# EAGLE design EggNunciator (EAGLE 4.13)
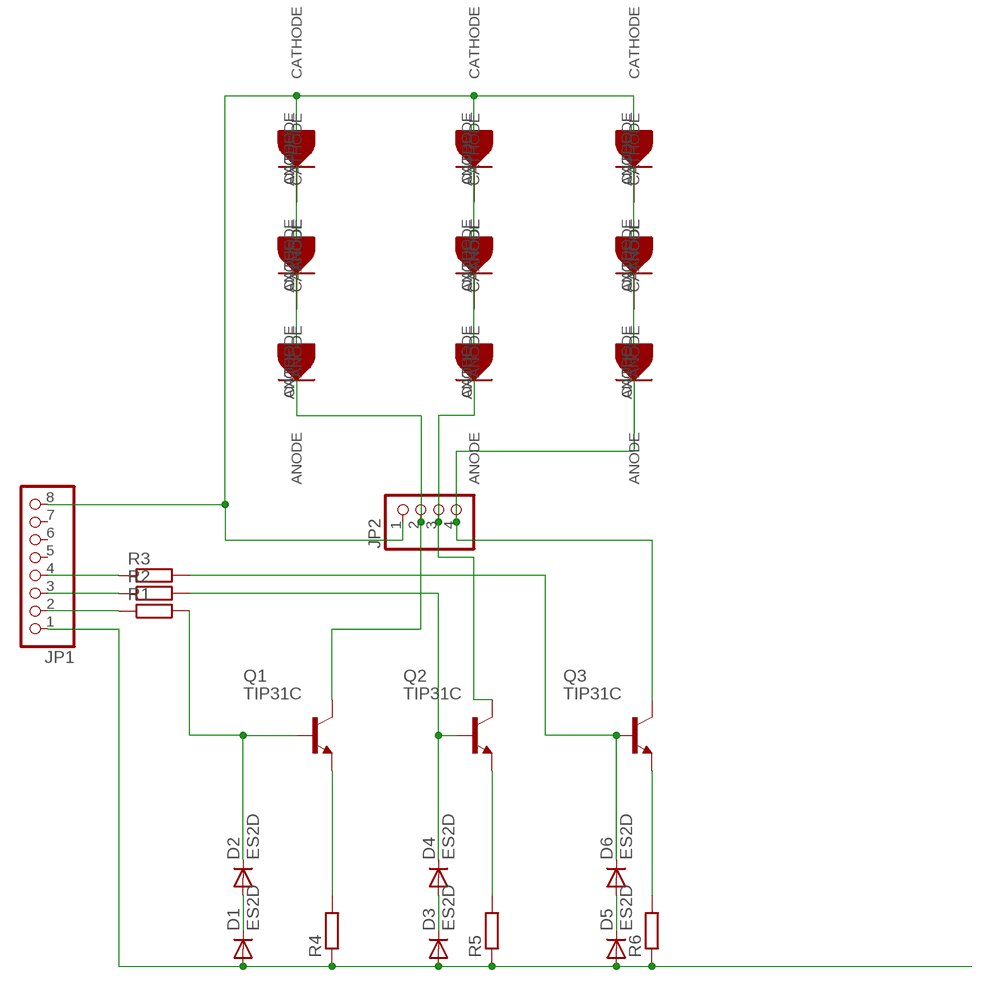
[diagram p0: schematic, sheet 1]

## Parts
D1  ES2D  [SMB]
D2  ES2D  [SMB]
D3  ES2D  [SMB]
D4  ES2D  [SMB]
D5  ES2D  [SMB]
D6  ES2D  [SMB]
JP1  PINHD-1X8  [1X08]
JP2  PINHD-1X4  [1X04]
Q1  TIP31C  [TO220]
Q2  TIP31C  [TO220]
Q3  TIP31C  [TO220]
R1  R-EU_M1206  [M1206]
R2  R-EU_M1206  [M1206]
R3  R-EU_M1206  [M1206]
R4  R-EU_0207/10  [0207/10]
R5  R-EU_0207/10  [0207/10]
R6  R-EU_0207/10  [0207/10]
RED  SUPERFLUXLED  [SUPERFLUXLED]
U$2  SUPERFLUXLED  [SUPERFLUXLED]
U$3  SUPERFLUXLED  [SUPERFLUXLED]
U$4  SUPERFLUXLED  [SUPERFLUXLED]
U$5  SUPERFLUXLED  [SUPERFLUXLED]
U$6  SUPERFLUXLED  [SUPERFLUXLED]
U$7  SUPERFLUXLED  [SUPERFLUXLED]
U$8  SUPERFLUXLED  [SUPERFLUXLED]
U$9  SUPERFLUXLED  [SUPERFLUXLED]

## Nets
GND: D1.A D3.A D5.A JP1.1 R4.1 R5.1 R6.1
N$2: JP1.2 R1.1
N$3: JP1.3 R2.1
N$4: JP1.4 R3.1
N$5: D1.C D2.A
N$6: D3.C D4.A
N$7: D5.C D6.A
N$8: D2.C Q1.1(B) R1.2
N$9: Q1.3(E) R4.2
N$10: D4.C Q2.1(B) R2.2
N$11: Q2.3(E) R5.2
N$12: Q3.3(E) R6.2
N$13: D6.C Q3.1(B) R3.2
N$14: JP1.8 JP2.1 U$3.CATHODE U$6.CATHODE U$9.CATHODE
N$15: JP2.2 Q1.2(C) RED.ANODE
N$16: JP2.3 Q2.2(C) U$4.ANODE
N$17: JP2.4 Q3.2(C) U$7.ANODE
N$18: U$7.CATHODE U$8.ANODE
N$19: U$4.CATHODE U$5.ANODE
N$20: RED.CATHODE U$2.ANODE
N$21: U$2.CATHODE U$3.ANODE
N$22: U$5.CATHODE U$6.ANODE
N$23: U$8.CATHODE U$9.ANODE
Unconnected: JP1.5 JP1.6 JP1.7

## Library data of the parts
D1-D6 = diode:ES2D: DIODE super fast rectifier, 2 A
JP1 = pinhead:PINHD-1X8: PIN HEADER
JP2 = pinhead:PINHD-1X4: PIN HEADER
Q1-Q3 = transistor-npn:TIP31C*: NPN Transistor
R1-R6 = rcl:R-EU_: RESISTOR, European symbol
RED U$2-U$9 = LumiLed:SUPERFLUXLED

## Board
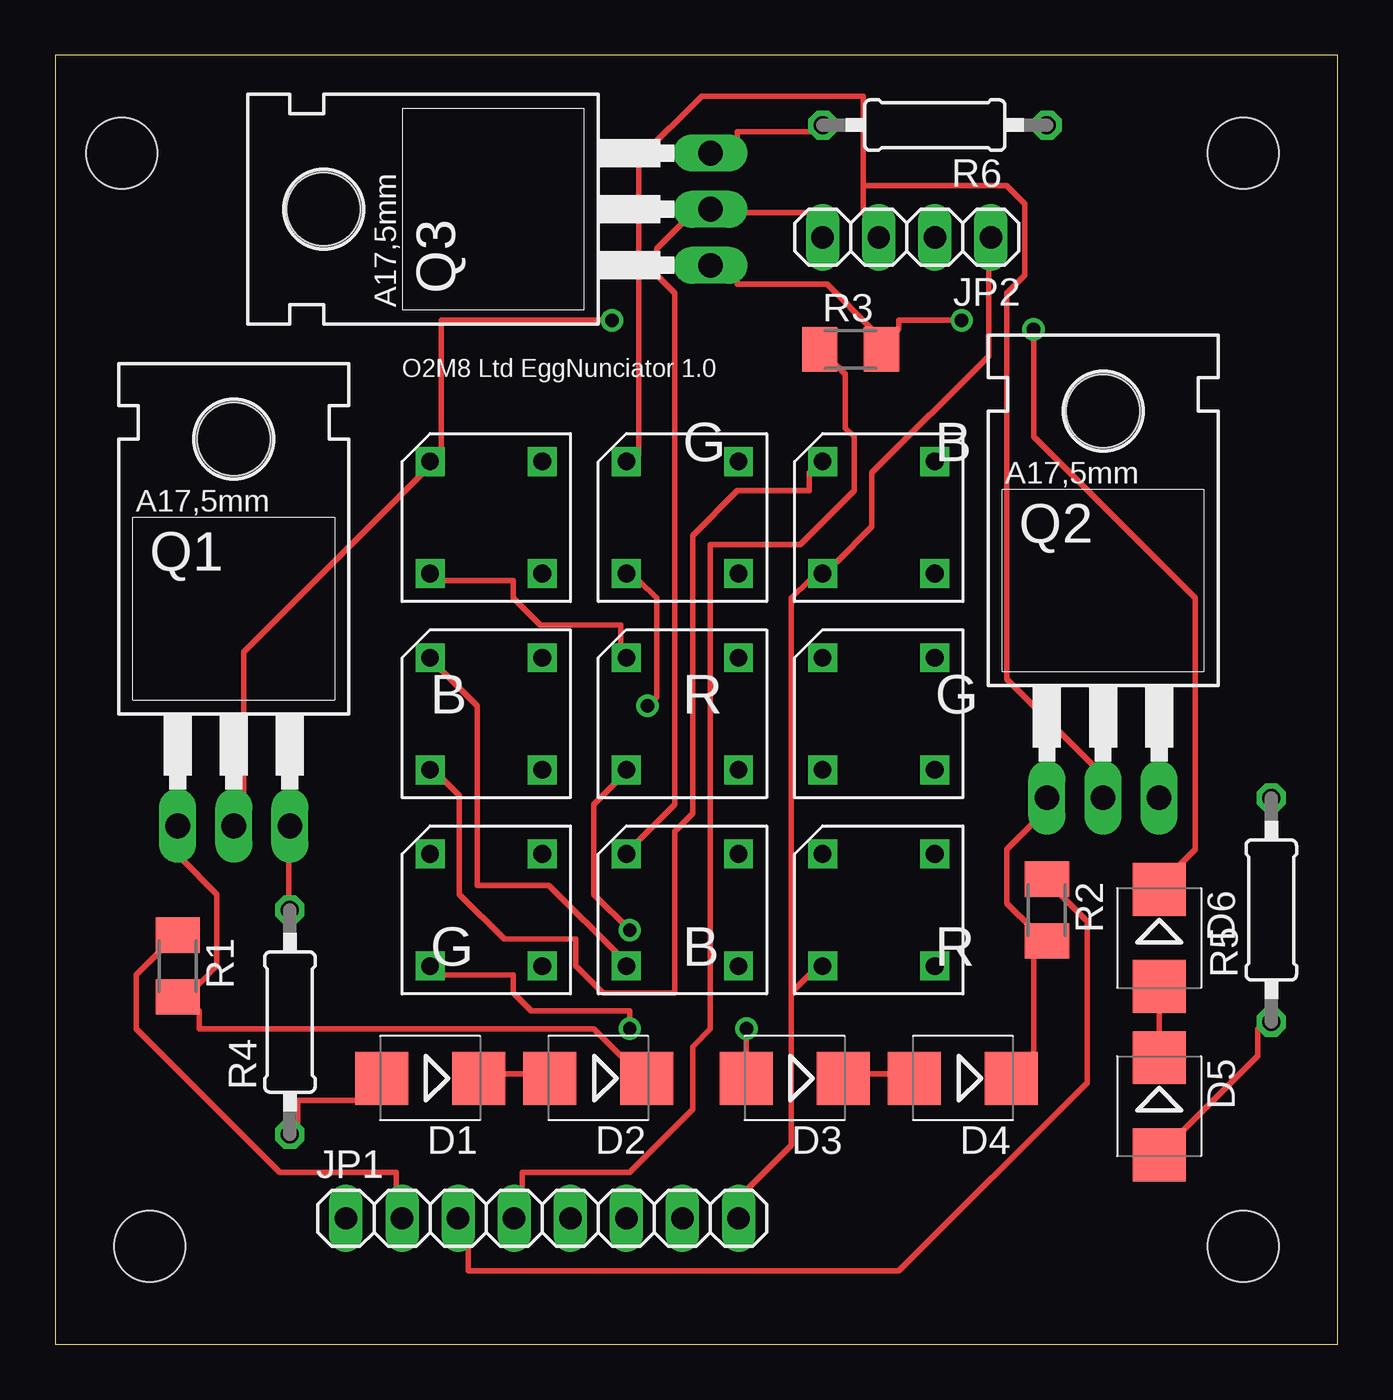
[diagram p1: board, top side]
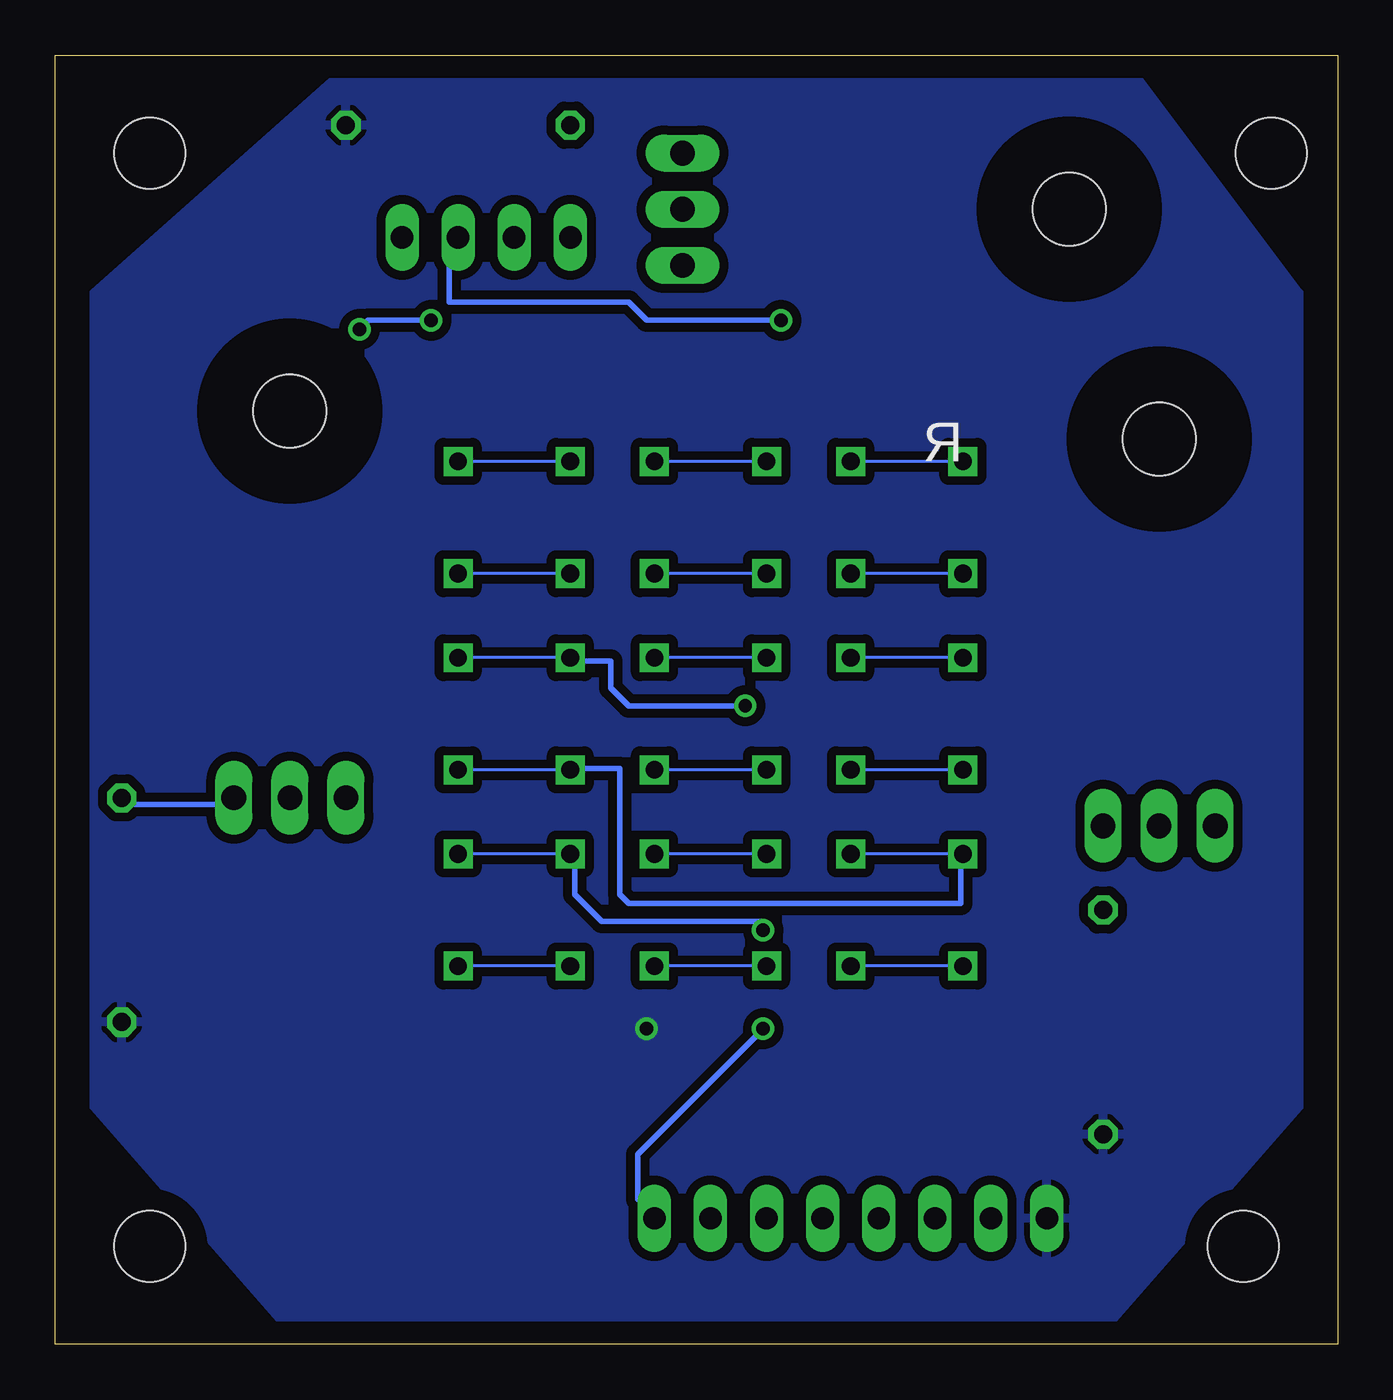
[diagram p2: board, bottom side, seen from below]

Size 58.09 x 58.41 mm. Coordinates in mm from the lower left corner, seen from the top.
Outline: 0,0 58.09,0 58.09,58.41 0,58.41 0,0
Copper layers (1*16): Top 0.035mm / dielectric 1.5mm / Bottom 0.035mm
Design rules "default": minimum track width 10mil, minimum drill 24mil, track to track 16mil, track to pad 16mil, pad to pad 12mil, via to via 12mil, smd to smd 12mil, copper to edge 40mil, drill to drill 8mil, minimum pad ring 10mil, minimum via ring 8mil, stop-mask expansion 4mil, vias tented up to drill 0mil, thermal gap 10mil
Holes 3.2 mm at 3.01,53.97 53.81,53.97 53.81,4.44 4.28,4.44

### Footprints (pad centres in the part's own frame; a part is rotated, then mirrored left to right if it is on the bottom)
SMB = smd 2.4 x 2.4: A 2.2,0; C -2.2,0
1X08 = drill 1.016 long: 1 -8.89,0; 2 -6.35,0; 3 -3.81,0; 4 -1.27,0; 5 1.27,0; 6 3.81,0; 7 6.35,0; 8 8.89,0
1X04 = drill 1.016 long: 1 -3.81,0; 2 -1.27,0; 3 1.27,0; 4 3.81,0
TO220 = drill 1.118 long: 1 -2.54,-6.35; 2 0,-6.35; 3 2.54,-6.35 | hole 3.302: 0,11.176
M1206 = smd 1.6 x 2: 1 -1.4,0; 2 1.4,0
0207/10 = drill 0.813 octagon: 1 -5.08,0; 2 5.08,0
SUPERFLUXLED = drill 0.8 square: ANODE -2.54,2.54; CATHODE -2.54,-2.54; P$2 2.54,2.54; P$4 2.54,-2.54

### Placement (x,y rotation side)
D1  16.98,12.06 180 top
D2  24.6,12.06 180 top
D3  33.49,12.06 180 top
D4  41.11,12.06 180 top
D5  50,10.79 270 top
D6  50,18.41 270 top
JP1  22.06,5.71 0 top
JP2  38.57,50.16 180 top
Q1  8.09,29.84 0 top
Q2  47.46,31.11 0 top
Q3  23.33,51.43 90 top
R1  5.55,17.14 270 top
R2  44.92,19.68 270 top
R3  36.03,45.08 0 top
R4  10.63,14.6 90 top
R5  55.08,19.68 90 top
R6  39.84,55.24 180 top
RED  19.52,37.46 0 top
U$2  28.41,28.57 0 top
U$3  37.3,19.68 0 top
U$4  28.41,37.46 0 top
U$5  37.3,28.57 0 top
U$6  19.52,19.68 0 top
U$7  28.41,19.68 0 top
U$8  19.52,28.57 0 top
U$9  37.3,37.46 0 top

### Tracks (layer width: path | path; a pad name or v marks a point on that pad's centre or on a via)
GND  (via drill 0.61)
  Top 0.254: D1.A 13.83,11.04 10.99,11.04 10.99,9.82 R4.1 | v31.31,14.3 31.31,13.08 D3.A | D5.A 50.81,9.42 54.47,13.08 54.47,14.3 R5.1
  pour Bottom: 1.74,47.62 9.36,57.78 44.92,57.78 56.35,47.62 56.35,10.79 47.46,0.63 10.63,0.63 1.74,10.79
N$2
  Top 0.254: R1.1 4.89,17.95 3.67,16.73 3.67,14.3 10.17,7.79 15.46,7.79 15.46,6.98 JP1.2
N$3
  Top 0.254: R2.1 45.53,20.39 46.75,19.17 46.75,11.86 38.21,3.32 18.71,3.32 18.71,4.54 JP1.3
N$4
  Top 0.254: R3.1 35.37,44.37 35.78,43.96 35.78,41.52 36.18,41.12 36.18,38.68 33.74,36.24 29.68,36.24 29.68,14.3 28.87,13.48 28.87,10.64 26.02,7.79 21.15,7.79 21.15,6.98 JP1.4
N$5
  Top 0.254: D1.C 20.33,12.26 21.55,12.26 D2.A
N$6
  Top 0.254: D3.C 36.59,12.26 37.81,12.26 D4.A
N$7
  Top 0.254: D5.C D6.A
N$8
  Top 0.254: Q1.1 5.7,22.02 7.33,20.39 7.33,17.14 6.52,16.33 R1.2 6.52,15.11 6.52,14.3 24.4,14.3 25.62,13.08 D2.C
N$9
  Top 0.254: R4.2 10.58,19.99 10.58,22.02 Q1.3
N$10
  Top 0.254: D4.C 44.31,13.08 44.31,17.55 R2.2 44.31,18.77 43.09,19.99 43.09,22.42 44.31,23.64 Q2.1
N$11
  Bottom 0.254: R5.2 54.47,24.46 50.81,24.46 Q2.3
N$12
  Top 0.254: R6.2 34.15,54.94 30.9,54.94 30.9,54.53 Q3.3
N$13  (via drill 0.61)
  Top 0.254: Q3.1 30.9,48.43 30.9,48.03 34.96,48.03 37,45.99 R3.2 38.21,45.99 38.21,46.4 v41.06,46.4 | v44.31,45.99 44.31,41.12 51.63,33.8 51.63,22.42 50.81,21.61 D6.C
  Bottom 0.254: v44.31,45.99 43.9,46.4 v41.06,46.4
N$14  (via drill 0.61)
  Top 0.254: v26.02,14.3 26.02,15.11 21.55,15.11 20.74,15.92 20.74,16.73 17.49,16.73 U$6.CATHODE | 33.34,15.92 34.15,16.73 U$3.CATHODE | 33.34,15.92 33.34,9.01 31.31,6.98 JP1.8 | 33.34,15.92 33.34,33.8 34.15,34.61 U$9.CATHODE 35.37,35.43 37,37.05 37,39.49 42.28,44.78 42.28,48.84 JP2.1
  Bottom 0.254: v26.02,14.3 31.71,8.61 31.71,6.57 31.31,6.57 JP1.8
N$15  (via drill 0.61)
  Top 0.254: Q1.2 8.55,24.86 8.55,31.36 16.68,39.49 RED.ANODE 17.49,40.31 17.49,46.4 v25.21,46.4
  Bottom 0.254: v25.21,46.4 31.31,46.4 32.12,47.21 40.25,47.21 40.25,48.84 JP2.2
N$16
  Top 0.254: 36.59,52.5 36.59,51.28 JP2.3 | 36.59,52.5 36.59,56.56 29.27,56.56 26.43,53.72 26.43,40.31 U$4.ANODE | 36.59,52.5 43.09,52.5 43.9,51.68 43.9,48.43 43.09,47.62 43.09,30.14 47.16,26.08 Q2.2
N$17
  Top 0.254: U$7.ANODE 26.43,22.83 28.05,24.46 28.05,47.62 27.24,48.43 27.24,49.65 28.46,50.87 Q3.2 31.31,51.28 34.15,51.28 JP2.4
N$18
  Top 0.254: U$7.CATHODE 25.62,17.55 22.36,20.8 19.11,20.8 19.11,28.93 17.49,30.55 U$8.ANODE
N$19  (via drill 0.61)
  Top 0.254: v26.83,28.93 27.24,29.33 27.24,33.8 26.43,34.61 U$4.CATHODE
  Bottom 0.254: v26.83,28.93 32.12,28.93 32.93,29.74 32.93,30.96 34.15,30.96 U$5.ANODE
N$20
  Top 0.254: RED.CATHODE 17.49,34.61 20.74,34.61 20.74,33.8 21.96,32.58 25.62,32.58 25.62,31.36 U$2.ANODE
N$21  (via drill 0.61)
  Top 0.254: v26.02,18.77 24.4,20.39 24.4,24.46 25.62,25.67 U$2.CATHODE
  Bottom 0.254: v26.02,18.77 26.02,19.17 33.34,19.17 34.56,20.39 34.56,21.61 U$3.ANODE
N$22
  Bottom 0.254: U$6.ANODE 17.08,21.61 17.08,19.99 32.12,19.99 32.53,20.39 32.53,26.08 34.15,26.08 U$5.CATHODE
N$23
  Top 0.254: U$8.CATHODE 17.49,25.67 18.3,24.86 18.3,20.39 20.33,18.36 23.58,18.36 23.58,17.14 24.8,15.92 28.05,15.92 28.05,23.24 28.87,24.05 28.87,36.65 30.9,38.68 34.15,38.68 34.15,39.49 U$9.ANODE

### Text on the board
tNames: O2M8 Ltd EggNunciator 1.0 | G | B | B | R | G | G | B | R
bNames: R